# EAGLE design board (EAGLE 9.6.2)
CDESIGNER: Kihun Song; CNAME: ESP8266EX Custom Board; CREVISION: 0.1.0
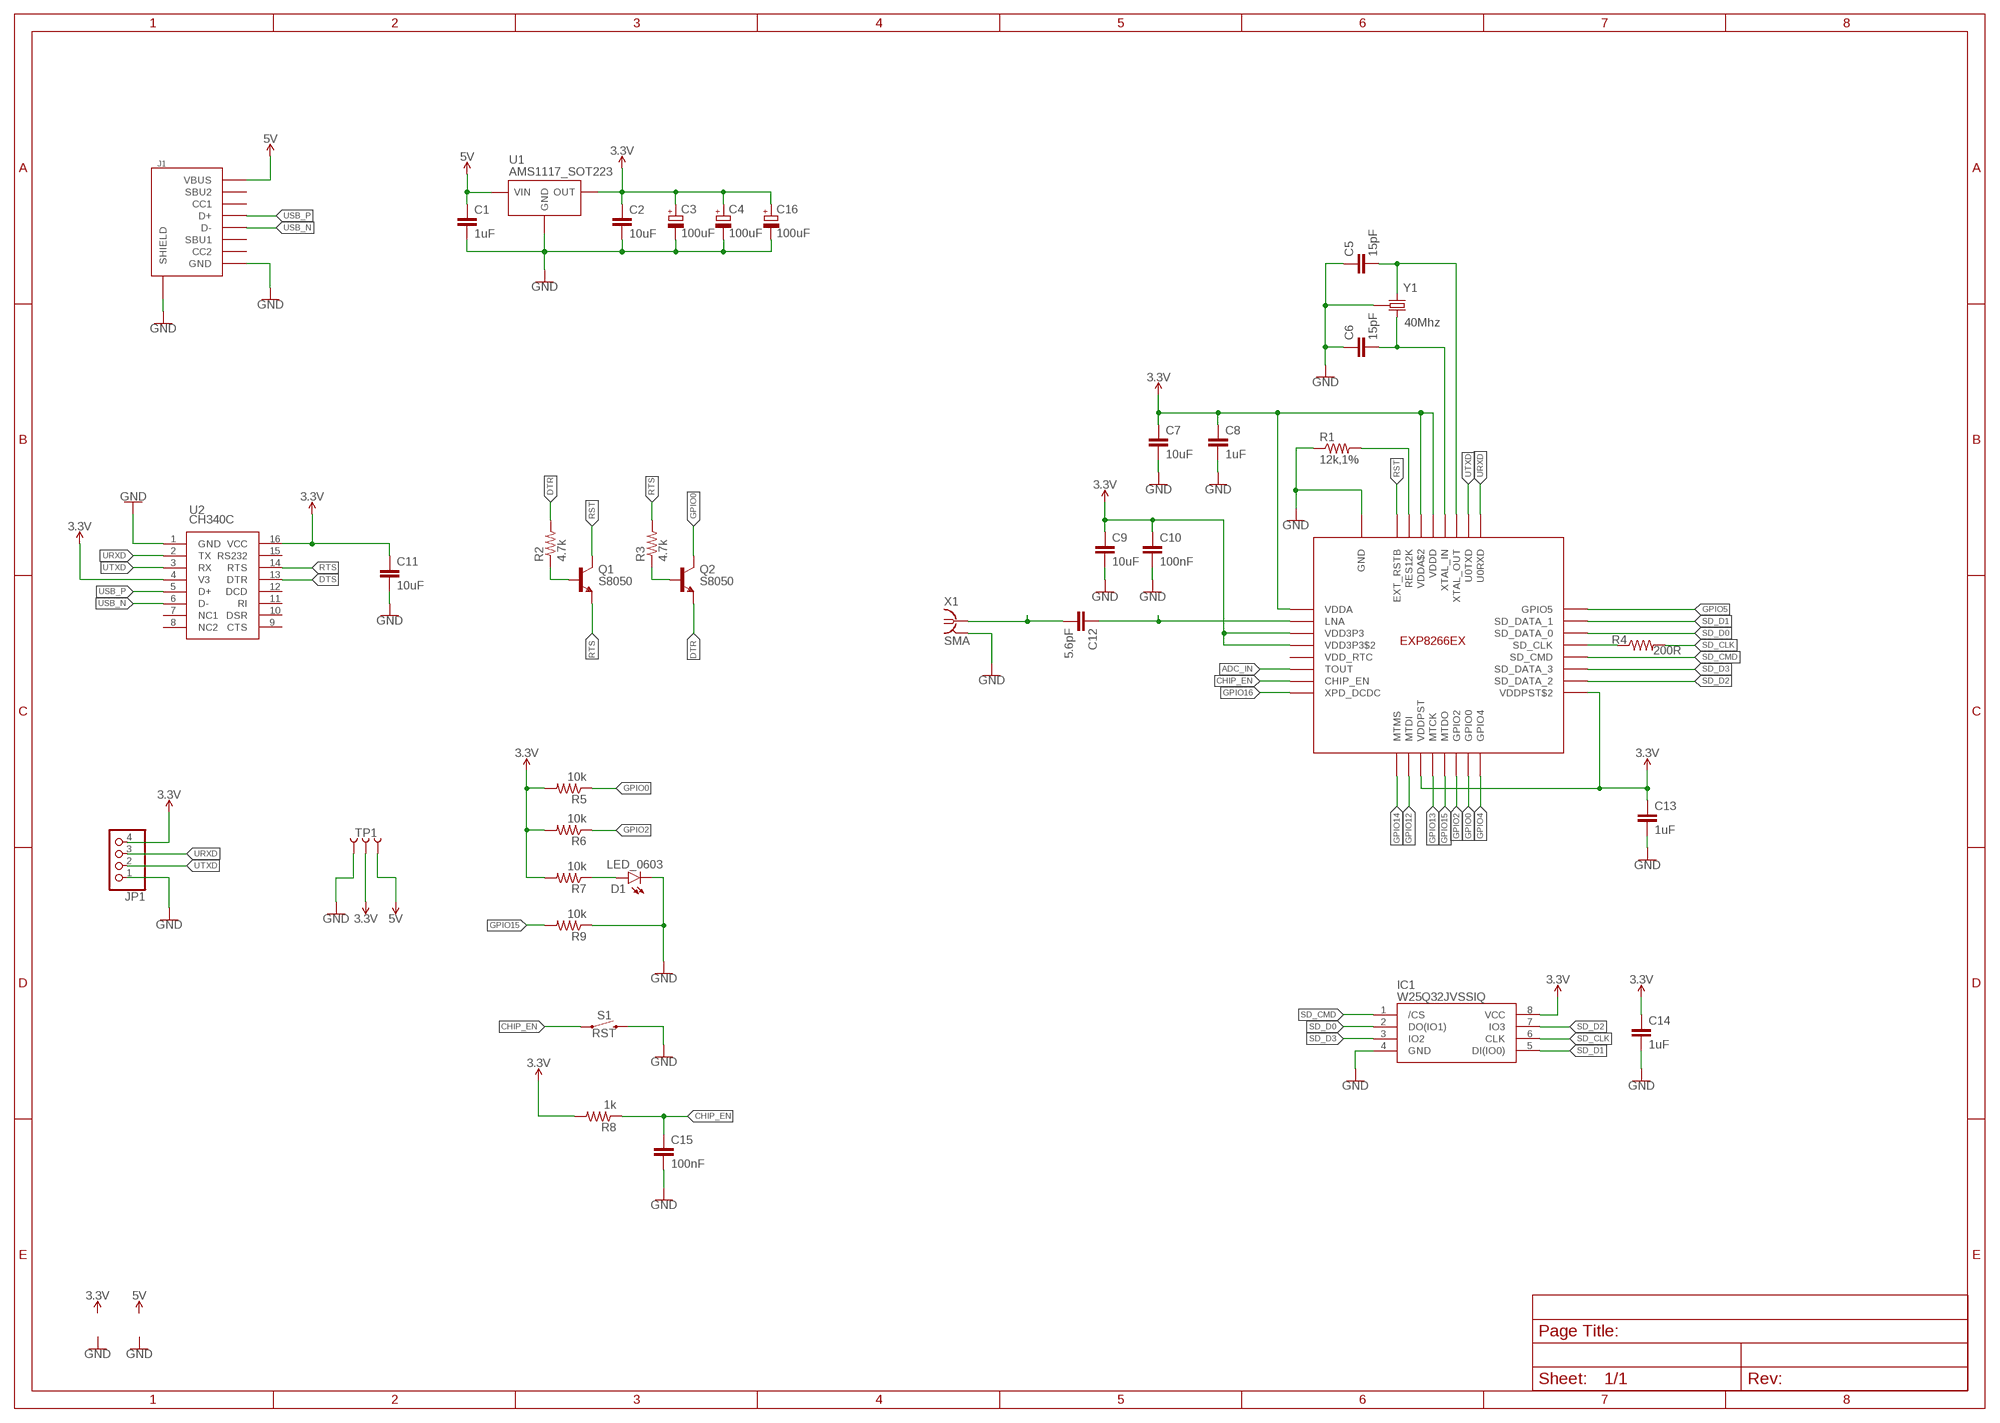
[diagram p0: schematic, sheet 1]

## Parts
C1  1uF  C-NON-POLC0402  [C0402]
C2  10uF  C-NON-POLC0402  [C0402]
C3  100uF  C-POLARIZEDSMCB  [SMC_B]
C4  100uF  C-POLARIZEDSMCB  [SMC_B]
C5  15pF  C-NON-POLC0402  [C0402]
C6  15pF  C-NON-POLC0402  [C0402]
C7  10uF  C-NON-POLC0402  [C0402]
C8  1uF  C-NON-POLC0402  [C0402]
C9  10uF  C-NON-POLC0402  [C0402]
C10  100nF  C-NON-POLC0402  [C0402]
C11  10uF  C-NON-POLC0402  [C0402]
C12  5.6pF  C-NON-POLC0402  [C0402]
C13  1uF  C-NON-POLC0402  [C0402]
C14  1uF  C-NON-POLC0402  [C0402]
C15  100nF  C-NON-POLC0402  [C0402]
C16  100uF  C-POLARIZEDSMCB  [SMC_B]
D1  LED_0603  [LED_0603]
IC1  W25Q32JVSSIQ  [SOIC-8_208MIL]
J1  USB-TYPE-C-31-M-12  [USB-TYPE-C-31-M-12]
JP1  PINHD-1X4/OCT  [1X04/OCT]
Q1  S8050  [SOT-23-3]
Q2  S8050  [SOT-23-3]
R1  12k,1%  RR0402  [R0402]
R2  4.7k  RR0402  [R0402]
R3  4.7k  RR0402  [R0402]
R4  200R  RR0402  [R0402]
R5  10k  RR0402  [R0402]
R6  10k  RR0402  [R0402]
R7  10k  RR0402  [R0402]
R8  1k  RR0402  [R0402]
R9  10k  RR0402  [R0402]
S1  RST  SWITCH-SPST-SMD-6.0X3.5MM  [TACTILE_SWITCH_SMD_6.0X3.5MM]
TP1  TEST-POINT-3  [PAD-3X-RECT-SILK]
U1  AMS1117_SOT223  [SOT-223]
U2  CH340C  [SOIC16]
U3  ESP8266EX  [ESP8266EX]
X1  SMA  SMA_END-LAUNCH-1  [SMA-END-LAUNCH-2]
Y1  40Mhz  CRYSTAL-40MHZ_2520  [CRYSTAL-SMD-2X2.5MM]

## Nets
3.3V [power]: C2.1 C3.+ C4.+ C7.1 C8.1 C9.1 C10.1 C11.1 C13.1 C14.1 C16.+ IC1.8(VCC) JP1.4 R5.2 R6.2 R7.2 R8.2 TP1.P$2 U1.2(OUT) U1.4(OUT) U2.4(V3) U2.16(VCC) U3.VDD3P3 U3.VDD3P3$2 U3.VDDA U3.VDDA$2 U3.VDDD U3.VDDPST U3.VDDPST$2
5V [power]: C1.1 J1.VBUS1(VBUS) J1.VBUS2(VBUS) TP1.P$3 U1.3(VIN)
ADC_IN: U3.TOUT
CHIP_EN: C15.1 R8.1 S1.1 U3.CHIP_EN
DTR: Q2.2(E) R2.2
DTS: U2.13(DTR)
GND [power]: C1.2 C2.2 C3.- C4.- C5.1 C6.1 C7.2 C8.2 C9.2 C10.2 C11.2 C13.2 C14.2 C15.2 C16.- D1.C IC1.4(GND) J1.GND1(GND) J1.GND2(GND) J1.SHLD-B1(SHIELD) J1.SHLD-B2(SHIELD) J1.SHLD-B3(SHIELD) J1.SHLD-B4(SHIELD) J1.SHLD-T1(SHIELD) J1.SHLD-T2(SHIELD) J1.SHLD-T3(SHIELD) J1.SHLD-T4(SHIELD) JP1.1 R1.1 R9.1 S1.2 TP1.P$1 U1.1(GND) U2.1(GND) U3.GND X1.G@1 X1.G@2 X1.G@3 X1.G@4 Y1.P2(GND) Y1.P4(GND)
GPIO0: Q2.3(C) R5.1 U3.GPIO0
GPIO2: R6.1 U3.GPIO2
GPIO4: U3.GPIO4
GPIO5: U3.GPOIO5(GPIO5)
GPIO12: U3.MTDI
GPIO13: U3.MTCK
GPIO14: U3.MTMS
GPIO15: R9.2 U3.MTDO
GPIO16: U3.XPD_DCDC
N$1: C6.2 U3.XTAL_IN Y1.P3
N$2: C5.2 U3.XTAL_OUT Y1.P1
N$3: R4.1 U3.SD_CLK
N$4: R1.2 U3.RES12K
N$5: C12.1 U3.LNA
N$6: C12.2 X1.1
N$7: D1.A R7.1
N$8: Q1.1(B) R2.1
N$9: Q2.1(B) R3.1
RST: Q1.3(C) U3.EXT_RSTB
RTS: Q1.2(E) R3.2 U2.14(RTS)
SD_CLK: IC1.6(CLK) R4.2
SD_CMD: IC1.1(/CS) U3.SD_CMD
SD_D0: IC1.2(DO(IO1)) U3.SD_DATA_0
SD_D1: IC1.5(DI(IO0)) U3.SD_DATA_1
SD_D2: IC1.7(IO3) U3.SD_DATA_2
SD_D3: IC1.3(IO2) U3.SD_DATA_3
URXD: JP1.3 U2.2(TX) U3.U0RXD
USB_N: J1.A7(D-) J1.B7(D-) U2.6(D-)
USB_P: J1.A6(D+) J1.B6(D+) U2.5(D+)
UTXD: JP1.2 U2.3(RX) U3.U0TXD
Unconnected: J1.A5(CC1) J1.A8(SBU1) J1.B5(CC2) J1.B8(SBU2) U2.7(NC1) U2.8(NC2) U2.9(CTS) U2.10(DSR) U2.11(RI) U2.12(DCD) U2.15(RS232) U3.VDD_RTC

## Library data of the parts
C1 C8 C13 C14 = angrypig7-RCL:C-NON-POL; LCSC: C52923; SPICEPREFIX: C
C2 C7 C9 C11 = angrypig7-RCL:C-NON-POL; LCSC: C15525; SPICEPREFIX: C
C3 C4 C16 = angrypig7-RCL:C-POLARIZED; LCSC: C16133; SPICEPREFIX: C
C5 C6 = angrypig7-RCL:C-NON-POL; LCSC: C1548; SPICEPREFIX: C
C10 C15 = angrypig7-RCL:C-NON-POL; LCSC: C1525; SPICEPREFIX: C
C12 = angrypig7-RCL:C-NON-POL; LCSC: C318596; SPICEPREFIX: C
D1 = angrypig7-Diodes:LED; LCSC: C72038
IC1 = angrypig7-IC:W25Q32JVSSIQ; LCSC: C179173
J1 = angrypig7-Connectors:USB-TYPE-C-31-M-12: Type-C-31-M12 By Korean Hroparts Elec link <https://lcsc.com/product-detail/USB-Type-C_Korean-Hroparts-Elec-TYPE-C-31-M-12_C165948.html>; LCSC: C165948
JP1 = pinhead_v2:PINHD-1X4: PIN HEADER
Q1 Q2 = angrypig7-Transistors:S8050; LCSC: C2146
R1 = angrypig7-RCL:R; LCSC: C25752; SPICEPREFIX: R
R2 R3 = angrypig7-RCL:R; LCSC: C25900; SPICEPREFIX: R
R4 = angrypig7-RCL:R; LCSC: C25087; SPICEPREFIX: R
R5-R7 R9 = angrypig7-RCL:R; LCSC: C25744; SPICEPREFIX: R
R8 = angrypig7-RCL:R; LCSC: C11702; SPICEPREFIX: R
S1 = angrypig7-Switches:SWITCH-SPST; LCSC: C118141; PROD_ID: SWCH-14278; SF_SKU: COM-08229
TP1 = angrypig7-Tests:TEST-POINT-3
U1 = angrypig7-IC-Power:AMS1117; LCSC: C6186
U2 = angrypig7-IC:CH340C; LCSC: C14267
U3 = angrypig7-IC-MCU:ESP8266EX; LCSC: C77967
X1 = angrypig7-Connectors:SMA: FEMALE SMA CONNECTOR Radiall distributor RS 193-9117; LCSC: C496550
Y1 = angrypig7-Clocks:CRYSTAL-40MHZ; LCSC: C284176

## Net classes
0 default: width 0.203 mm
1 power: width 0.254 mm

## Board
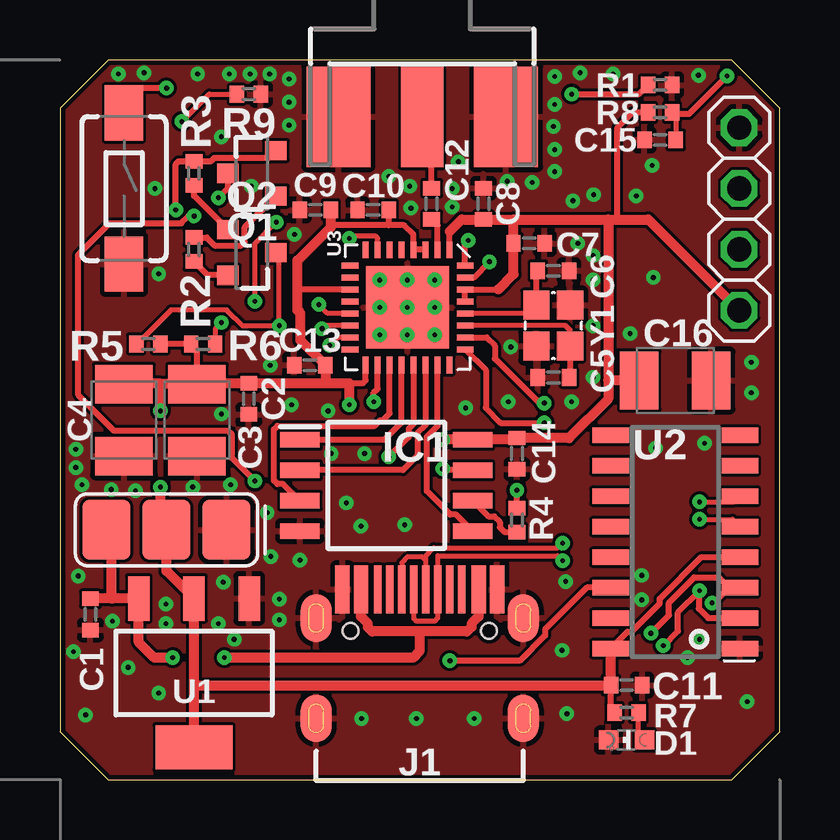
[diagram p1: board, top side]
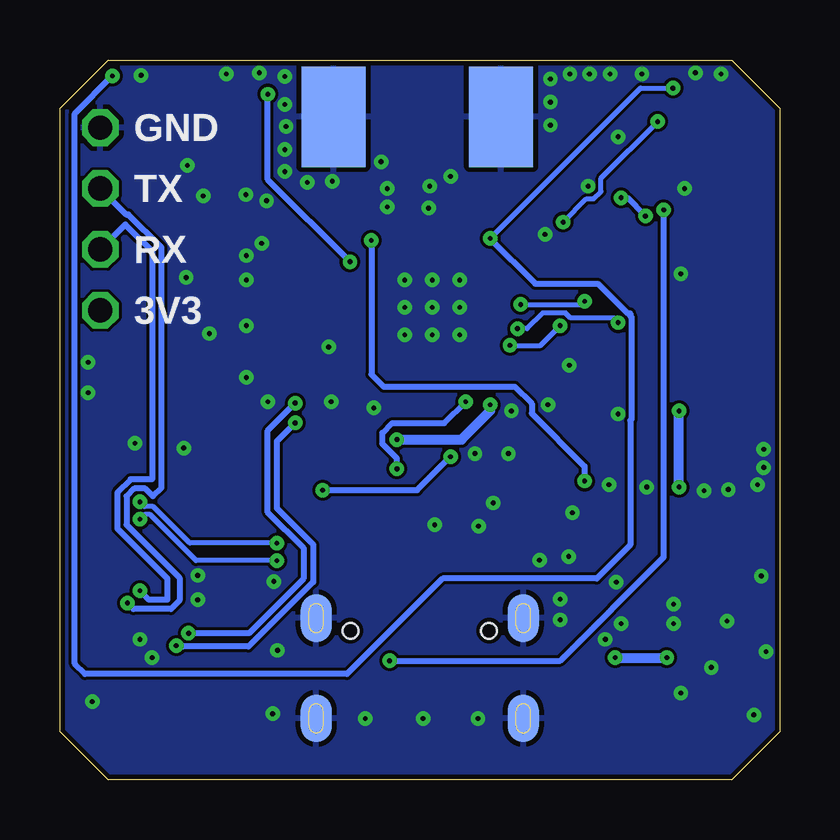
[diagram p2: board, bottom side, seen from below]

Size 30 x 30 mm. Coordinates in mm from the lower left corner, seen from the top.
Outline: 2,0 28,0 30,2 30,28 28,30 2,30 0,28 0,2 2,0
Copper layers (1*16): Top 0.035mm / dielectric 1.5mm / Bottom 0.035mm
Design rules "JLCPCB_2-Layer": minimum track width 5mil, minimum drill 0.2mm, track to track 5mil, track to pad 5mil, pad to pad 5mil, via to via 5mil, smd to smd 5mil, copper to edge 8mil, drill to drill 3mil, minimum pad ring 3mil, minimum via ring 0.2mm, stop-mask expansion 4mil, vias tented up to drill 15mil, thermal gap 8mil

### Footprints (pad centres in the part's own frame; a part is rotated, then mirrored left to right if it is on the bottom)
C0402 = smd 0.6 x 0.7: 1 -0.65,0; 2 0.65,0
SMC_B = smd 1.6 x 2.4: + 1.5,0; - -1.5,0
LED_0603 = smd 0.8 x 0.8: A 0.75,0; C -0.75,0
SOIC-8_208MIL = smd 0.65 x 1.65: 1 -1.905,-3.6; 2 -0.635,-3.6; 3 0.635,-3.6; 4 1.905,-3.6; 5 1.905,3.6; 6 0.635,3.6; 7 -0.635,3.6; 8 -1.905,3.6
USB-TYPE-C-31-M-12 = smd 0.3 x 2: A5 -1.25,1.19; A6 -0.25,1.19; A7 0.25,1.19; A8 1.25,1.19; B5 1.75,1.19; B6 0.75,1.19; B7 -0.75,1.19; B8 -1.75,1.19 | smd 0.6 x 2: GND1 -3.225,1.19; GND2 3.225,1.19; VBUS1 -2.45,1.19; VBUS2 2.45,1.19 | smd 1.3 x 2 bottom: SHLD-B1 -4.32,0; SHLD-B2 4.32,0; SHLD-B3 -4.32,-4.18; SHLD-B4 4.32,-4.18 | smd 1.3 x 2: SHLD-T1 -4.32,0; SHLD-T2 4.32,0; SHLD-T3 -4.32,-4.18; SHLD-T4 4.32,-4.18 | hole 0.65: -2.89,-0.53; 2.89,-0.53
1X04/OCT = drill 1.016 octagon: 1 -3.81,0; 2 -1.27,0; 3 1.27,0; 4 3.81,0
SOT-23-3 = smd 0.9 x 0.8: 1 1,-0.95; 2 1,0.95; 3 -1,0
R0402 = smd 0.6 x 0.7: 1 -0.5,0; 2 0.5,0
TACTILE_SWITCH_SMD_6.0X3.5MM = smd 2.3 x 1.6: 1 -3.15,0; 2 3.15,0
PAD-3X-RECT-SILK = smd 2 x 2.5: P$1 -2.5,0; P$2 0,0; P$3 2.5,0
SOT-223 = smd 1.85 x 0.9: 1 3.1,-2.3; 2 3.1,0; 3 3.1,2.3 | smd 1.85 x 3.2: 4 -3.1,0
SOIC16 = smd 0.635 x 1.524: 1 -4.445,-2.695; 2 -3.175,-2.695; 3 -1.905,-2.695; 4 -0.635,-2.695; 5 0.635,-2.695; 6 1.905,-2.695; 7 3.175,-2.695; 8 4.445,-2.695; 9 4.445,2.695; 10 3.175,2.695; 11 1.905,2.695; 12 0.635,2.695; 13 -0.635,2.695; 14 -1.905,2.695; 15 -3.175,2.695; 16 -4.445,2.695
ESP8266EX = smd 0.7 x 0.25: CHIP_EN -2.4,-1.25; GPOIO5 2.4,1.75; LNA -2.4,1.25; SD_CLK 2.4,0.25; SD_CMD 2.4,-0.25; SD_DATA_0 2.4,0.75; SD_DATA_1 2.4,1.25; SD_DATA_2 2.4,-1.25; SD_DATA_3 2.4,-0.75; TOUT -2.4,-0.75; VDD3P3 -2.4,0.75; VDD3P3$2 -2.4,0.25; VDD_RTC -2.4,-0.25; VDDA -2.4,1.75; VDDPST$2 2.4,-1.75; XPD_DCDC -2.4,-1.75 | smd 0.25 x 0.7: EXT_RSTB -1.75,2.4; GPIO0 1.25,-2.4; GPIO2 0.75,-2.4; GPIO4 1.75,-2.4; MTCK -0.25,-2.4; MTDI -1.25,-2.4; MTDO 0.25,-2.4; MTMS -1.75,-2.4; RES12K -1.25,2.4; U0RXD 1.75,2.4; U0TXD 1.25,2.4; VDDA$2 -0.75,2.4; VDDD -0.25,2.4; VDDPST -0.75,-2.4; XTAL_IN 0.25,2.4; XTAL_OUT 0.75,2.4 | smd 3.45 x 3.45: GND 0,0
SMA-END-LAUNCH-2 = smd 4.191 x 1.778: 1 2.115,0 | smd 4.191 x 2.667: G@1 2.115,3.495; G@2 2.115,-3.495 | smd 4.191 x 2.667 bottom: G@3 2.115,3.495; G@4 2.115,-3.495
CRYSTAL-SMD-2X2.5MM = smd 1.2 x 1.1: P1 0.846,0.69; P2 -0.854,0.69; P3 -0.854,-0.71; P4 0.846,-0.71

### Placement (x,y rotation side)
C1  1.27,6.88 270 top
C2  7.87,15.88 270 top
C3  5.71,14.99 90 top
C4  2.67,14.99 90 top
C5  20.57,16.76 0 top
C6  20.57,21.21 180 top
C7  19.56,22.35 0 top
C8  17.65,24 90 top
C9  10.64,23.75 180 top
C10  13.06,23.75 180 top
C11  23.62,3.94 0 top
C12  15.49,24 90 top
C13  10.41,17.27 180 top
C14  19.05,13.59 270 top
C15  25.02,26.67 180 top
C16  25.65,16.64 180 top
D1  23.62,1.65 0 top
IC1  13.6,12.26 270 top
J1  15,6.73 0 top
JP1  28.32,23.37 270 top
Q1  8,25.27 0 top
Q2  8,21.97 180 top
R1  25.02,28.96 180 top
R2  5.59,22.1 270 top
R3  5.59,25.27 90 top
R4  19.05,10.82 270 top
R5  3.68,18.16 0 top
R6  5.97,18.16 180 top
R7  23.62,2.79 180 top
R8  25.02,27.81 180 top
R9  7.87,28.57 180 top
S1  2.67,24.64 270 top
TP1  4.45,10.41 180 top
U1  5.59,4.45 90 top
U2  25.65,9.91 90 top
U3  14.49,19.68 270 top
X1  15.1,29.75 270 top
Y1  20.57,18.92 270 top

### Tracks (layer width: path | path; a pad name or v marks a point on that pad's centre or on a via)
3.3V  (via drill 0.2)
  Top 0.254: R7.2 22.97,2.94 C11.1 | 22.97,5.45 U2.16 23.66,6.16 23.83,6.16 25,7.34 25,7.53 26.75,9.27 U2.4 | C3.+ 5.71,17.91 R6.2 R5.2 | U3.VDD3P3 U3.VDD3P3$2 14.73,22.09 14.73,22.73 14.35,23.11 13.71,23.11 | C10.1 13.71,23.11 | U3.VDDPST$2 12.74,16.64 12.63,16.52 12.06,16.52 | 23.24,23.35 23.24,27.18 23.88,27.81 R8.2 | U3.VDDA 16.24,22.85 | 18.28,20.43 U3.VDDA$2 U3.VDDD | 11.29,23.03 11.38,23.11 13.71,23.11 | U3.VDDPST 9.92,20.43 9.91,20.45
  Top 0.406: U1.4 5.59,3.94 | 5.59,3.94 U1.2 4.45,8.69 TP1.P$2 4.19,10.67 v4.19,12.19 | v4.19,15.37 4.19,16.51 | 4.19,16.51 2.69,16.51 C4.+ | 4.19,16.51 5.69,16.51 C3.+ 5.75,16.52 C2.1 11.05,16.52 | 5.59,3.94 C11.1 22.97,5.45 | 11.05,16.52 12.06,16.52 v12.06,15.62 | 11.05,16.52 11.06,16.54 C13.1 10.03,18.31 10.03,19.44 9.91,19.56 9.91,20.45 9.91,21.64 11.29,23.03 C9.1 | 22.86,23.35 23.24,23.35 24.53,23.35 JP1.4 | 16.24,22.85 16.75,23.35 C8.1 18.92,23.35 | 18.28,20.43 18.91,21.07 C7.1 18.91,23.34 18.92,23.35 | 22.86,23.35 22.86,16.64 | 22.86,16.64 22.86,15.88 21.22,14.24 C14.1 18.98,14.17 IC1.8 v15.96,14.17 v15.95,14.17 | C16.+ 22.86,16.64 | 18.92,23.35 22.86,23.35
  Bottom 0.406: v4.19,12.19 v4.19,15.37 | v15.95,14.17 13.26,14.17 12.06,15.37 v12.06,15.62
5V  (via drill 0.2)
  Top 0.406: J1.VBUS2 17.45,6.79 17.16,6.5 17.16,6.36 16.97,6.17 14.99,6.17 | 14.99,6.17 13.02,6.17 12.84,6.35 12.84,6.5 12.55,6.79 J1.VBUS1 | 14.99,6.17 14.99,5.33 14.73,5.08 v6.86,5.08 | v4.7,5.08 3.94,5.08 3.29,5.73 U1.3 2.16,7.54 | 2.16,7.54 1.28,7.54 C1.1 | 2.16,7.54 2.16,10.2 TP1.P$3
  Bottom 0.406: v6.86,5.08 v4.7,5.08
CHIP_EN  (via drill 0.2)
  Top 0.203: R8.1 25.59,27.75 25.67,27.66 C15.1 | U3.CHIP_EN 13.24,22.57 13.15,22.66 12.17,22.66 v12.06,22.56
  Top 0.254: v27.81,29.34 26.22,27.75 25.59,27.75 | v4.45,28.83 3.33,28.83 2.67,28.17 S1.1
  Bottom 0.203: v12.06,22.56 5.8,28.83 v4.45,28.83
  Bottom 0.254: v27.81,29.34 29.38,27.77 29.38,4.83 28.96,4.4 18.03,4.4 14.05,8.38 7.62,8.38 6.22,9.78 6.22,14.96 6.18,15.01 6.18,19.28 6.22,19.32 6.22,19.43 6.33,19.43 7.57,20.68 10.18,20.68 v12.06,22.56
DTR
  Top 0.254: Q2.2 6.17,21.02 R2.2
GND  (via drill 0.2)
  other vias: 14.48,19.68 15.62,18.54 15.62,19.68 13.34,20.83 15.62,20.83 13.34,18.54 14.48,18.54 13.34,19.68 14.48,20.83 8.76,17.27 9.65,15.62 6.73,15.24 28.83,17.4 28.83,16.13 18.8,18.03 21.34,15.75 22.23,16.76 22.23,18.92 22.23,20.83 22.23,21.84 21.59,22.35 16.61,25.76 16.36,24.64 16.36,23.88 14.58,24.74 13.72,25.15 14.63,23.83 16.92,15.49 18.69,15.75 26.67,5.84 28.65,3.25 9.14,7.52 9.14,6.65 6.6,6.5 6.81,8.23 14.38,10.62 12.55,10.57 10.01,9.14 11.94,11.53 21.13,2.74 20.93,5.38 26.87,14.02 24.84,13.82 23.77,18.59 24.74,20.93 24.03,24.33 22.25,24.38 18.64,24.94 21.39,24.13 20.62,25.35 19.68,24.89 20.62,29.31 20.62,28.14 20.57,27.23 20.62,26.26 9.55,27.28 9.55,28.24 9.55,29.21 3.15,12.04 2.13,12.09 0.91,12.29 0.66,13 0.66,13.77 7.11,12.29 5.54,12.19 7.26,5.84 8.64,11.13 8.79,9.3 7.98,24.74 24.69,25.6 8.74,29.41 7.92,29.41 7.06,29.41 23.06,29.41 21.69,29.46 26.62,29.36 5.74,29.41 3.51,29.46 2.44,29.41 4.11,21.08 3.96,24.64 4.42,6.5 4.42,7.32 4.11,3.61 2.84,4.67 1.07,2.69 0.76,8.48 2.18,6.6 0.56,5.33 17.27,2.54 14.86,2.54 12.57,2.54 26.16,5.08 24.26,8.51 24.26,7.49 21.08,8.26 12.7,13.59 11.3,13.59 11.18,15.37 9.78,22.73 6.73,26.8
  pour Top: 0,0 0,30 30,30 30,0
  pour Bottom: 0,30 0,0 30,0 30,30
GPIO0  (via drill 0.2)
  Top 0.203: R5.1 3.21,18.16 4.63,19.58 6.95,19.58 7.61,18.92 v9.14,18.92 9.14,21.83 Q2.3 | U3.GPIO0 11.57,18.43 v11.24,18.1
  Bottom 0.203: v11.24,18.1 9.97,18.1 v9.14,18.92
GPIO2  (via drill 0.2)
  Top 0.203: v6.73,19.05 6.47,18.79 R6.1 | U3.GPIO2 11.06,18.93 v10.92,18.8
  Bottom 0.203: v6.73,19.05 6.92,19.24 8.71,19.24 8.93,19.45 9.87,19.45 10.53,18.8 v10.92,18.8
GPIO15  (via drill 0.2)
  Top 0.203: U3.MTDO 11.17,19.43 v10.79,19.81 | v8.13,19.94 8.13,22.35 v9.02,23.24 | v5.08,27.43 6.22,28.57 R9.2
  Bottom 0.203: v10.79,19.81 8.26,19.81 v8.13,19.94 | v5.08,27.43 7.45,25.07 7.45,24.52 7.76,24.21 8.05,24.21 v9.02,23.24
N$1
  Top 0.203: Y1.P3 19.52,19.43 U3.XTAL_IN
  Top 0.254: Y1.P3 19.86,21.15 C6.2
N$2
  Top 0.203: Y1.P1 21.26,18.74 21.07,18.93 U3.XTAL_OUT
  Top 0.254: Y1.P1 21.26,16.8 C5.2
N$3  (via drill 0.2)
  Top 0.203: 14.74,14.82 14.69,14.77
  Top 0.254: 14.69,14.77 14.53,14.62 14.53,14.28 v13.72,13.46 | R4.1 v19.05,12.06 | U3.SD_CLK 14.74,14.82
  Bottom 0.254: v19.05,12.06 15.11,12.06 v13.72,13.46
N$4  (via drill 0.2)
  Top 0.254: U3.RES12K 17.25,20.93 v17.91,21.59 | v21.34,28.57 24.14,28.57 R1.2
  Bottom 0.254: v17.91,21.59 21.34,25.02 v21.34,28.57
N$5
  Top 0.254: U3.LNA 15.74,23.11 C12.1
N$6
  Top 0.254: C12.2 15.49,27.24 X1.1
N$7
  Top 0.203: D1.A 24.12,1.9 R7.1
N$8
  Top 0.254: Q1.1 7.71,23.03 7.71,22.42 7.56,22.27 6.45,22.27 6.12,22.6 R2.1
N$9
  Top 0.254: Q2.1 5.59,24.33 R3.1
RST  (via drill 0.2)
  Top 0.254: U3.EXT_RSTB 16.89,22.35 v17.02,22.48 | v8.13,12.45 7.17,13.4 7.17,14.39 7.02,14.54 2.25,14.54 0.76,16.03 0.76,21.89 2.06,23.2 5.05,23.2 5.36,23.5 v5.59,23.5 | v6.6,24.26 7,24.65 Q1.3
  Bottom 0.254: v17.02,22.48 17.02,16.89 16.51,16.38 11.05,16.38 10.33,15.67 10.33,15.27 8.13,13.06 v8.13,12.45 | v5.59,23.5 6.35,24.26 v6.6,24.26
RTS  (via drill 0.2)
  Top 0.254: Q1.2 8.71,25.93 6.45,25.93 6.29,25.77 R3.2 4.95,25.77 4.83,25.65 v4.83,23.75 | U2.14 21.97,8 20.22,6.25 20.22,6.01 19.17,4.95 v16.26,4.95
  Bottom 0.254: v16.26,4.95 9.14,4.95 4.83,9.27 v4.83,23.75
SD_CLK
  Top 0.254: IC1.6 17.86,10.97 18.1,10.97 18.34,10.73 18.34,10.52 18.53,10.32 R4.2
SD_CMD
  Top 0.254: IC1.1 13.53,14.17 14.24,14.88 U3.SD_CMD
SD_D0
  Top 0.254: U3.SD_DATA_0 15.24,14.79 14.91,14.46 14.91,13.52 14.29,12.9 IC1.2
SD_D1
  Top 0.254: IC1.5 16.51,11.05 16.27,11.05 15.3,12.03 15.3,14.3 15.74,14.75 U3.SD_DATA_1
SD_D2  (via drill 0.2)
  Top 0.254: IC1.7 16.01,12.9 v15.95,12.95 | v13.08,15.75 13.08,16.13 13.24,16.29 U3.SD_DATA_2
  Bottom 0.254: v13.08,15.75 13.97,14.86 16.15,14.86 16.56,14.45 16.56,13.99 15.95,13.39 v15.95,12.95
SD_D3
  Top 0.254: IC1.3 9.31,12.32 9.07,12.32 8.92,12.47 8.92,14.6 9.07,14.75 13.12,14.75 13.36,14.99 13.46,14.99 13.74,15.27 U3.SD_DATA_3
URXD  (via drill 0.2)
  Top 0.254: U2.2 27.03,6.73 26.63,7.13 26.63,7.83 v26.67,7.87 25.77,6.97 25.77,6.2 v25.15,5.58 | U3.U0RXD 17.75,17.08 17.75,15.49 18.37,14.87 v20.19,14.87
  Bottom 0.254: v26.67,7.87 26.29,7.49 25.53,7.49 25.53,8.38 27.61,10.46 27.61,11.96 27.06,12.51 26.16,12.51 26.16,22.04 27.27,23.15 JP1.3 | v25.15,5.58 24.91,5.58 24.87,5.54 22.14,5.54 19.45,8.23 19.45,9.79 20.95,11.3 20.95,14.11 v20.19,14.87
USB_N  (via drill 0.2)
  Top 0.203: J1.B7 14.25,9.04 14.48,9.27 15.11,9.27 15.25,9.13 J1.A7 15.25,9.33 15.58,9.66 20.76,9.66 v20.95,9.86 | v26.67,11.58 28.12,11.58 U2.6
  Bottom 0.203: v20.95,9.86 24.59,9.86 26.11,11.38 26.47,11.38 v26.67,11.58
USB_P  (via drill 0.2)
  Top 0.203: J1.A6 14.75,6.71 14.86,6.6 15.62,6.6 15.75,6.73 J1.B6 15.75,9.33 20.76,9.33 v20.95,9.13 | v26.67,10.85 28.04,10.85 U2.5
  Bottom 0.203: v20.95,9.13 24.33,9.13 26.25,11.05 26.47,11.05 v26.67,10.85
UTXD  (via drill 0.2)
  Top 0.254: 27.9,8 27.26,7.36 v27.18,7.36 | 27.9,8 U2.3 | 27.9,8 27.48,8.43 26.44,8.43 25.39,7.37 25.39,6.84 v24.64,6.1 | U3.U0TXD 17.79,18.43 18.13,18.09 18.13,17.55 19.99,15.69 v20.19,15.69
  Bottom 0.254: v27.18,7.36 26.94,7.11 25.37,7.11 25.02,7.46 25.02,8.42 27.22,10.62 27.22,11.81 26.9,12.13 26.44,12.13 26.13,11.82 25.78,12.16 25.78,22.19 27.15,23.56 27.24,23.56 JP1.2 | v24.64,6.1 22.12,6.1 19.85,8.37 19.85,9.66 21.34,11.14 21.34,14.55 v20.19,15.69

### Text on the board
bPlace: GND | TX | RX | 3V3